# EAGLE design breakout (EAGLE 7.4.0)
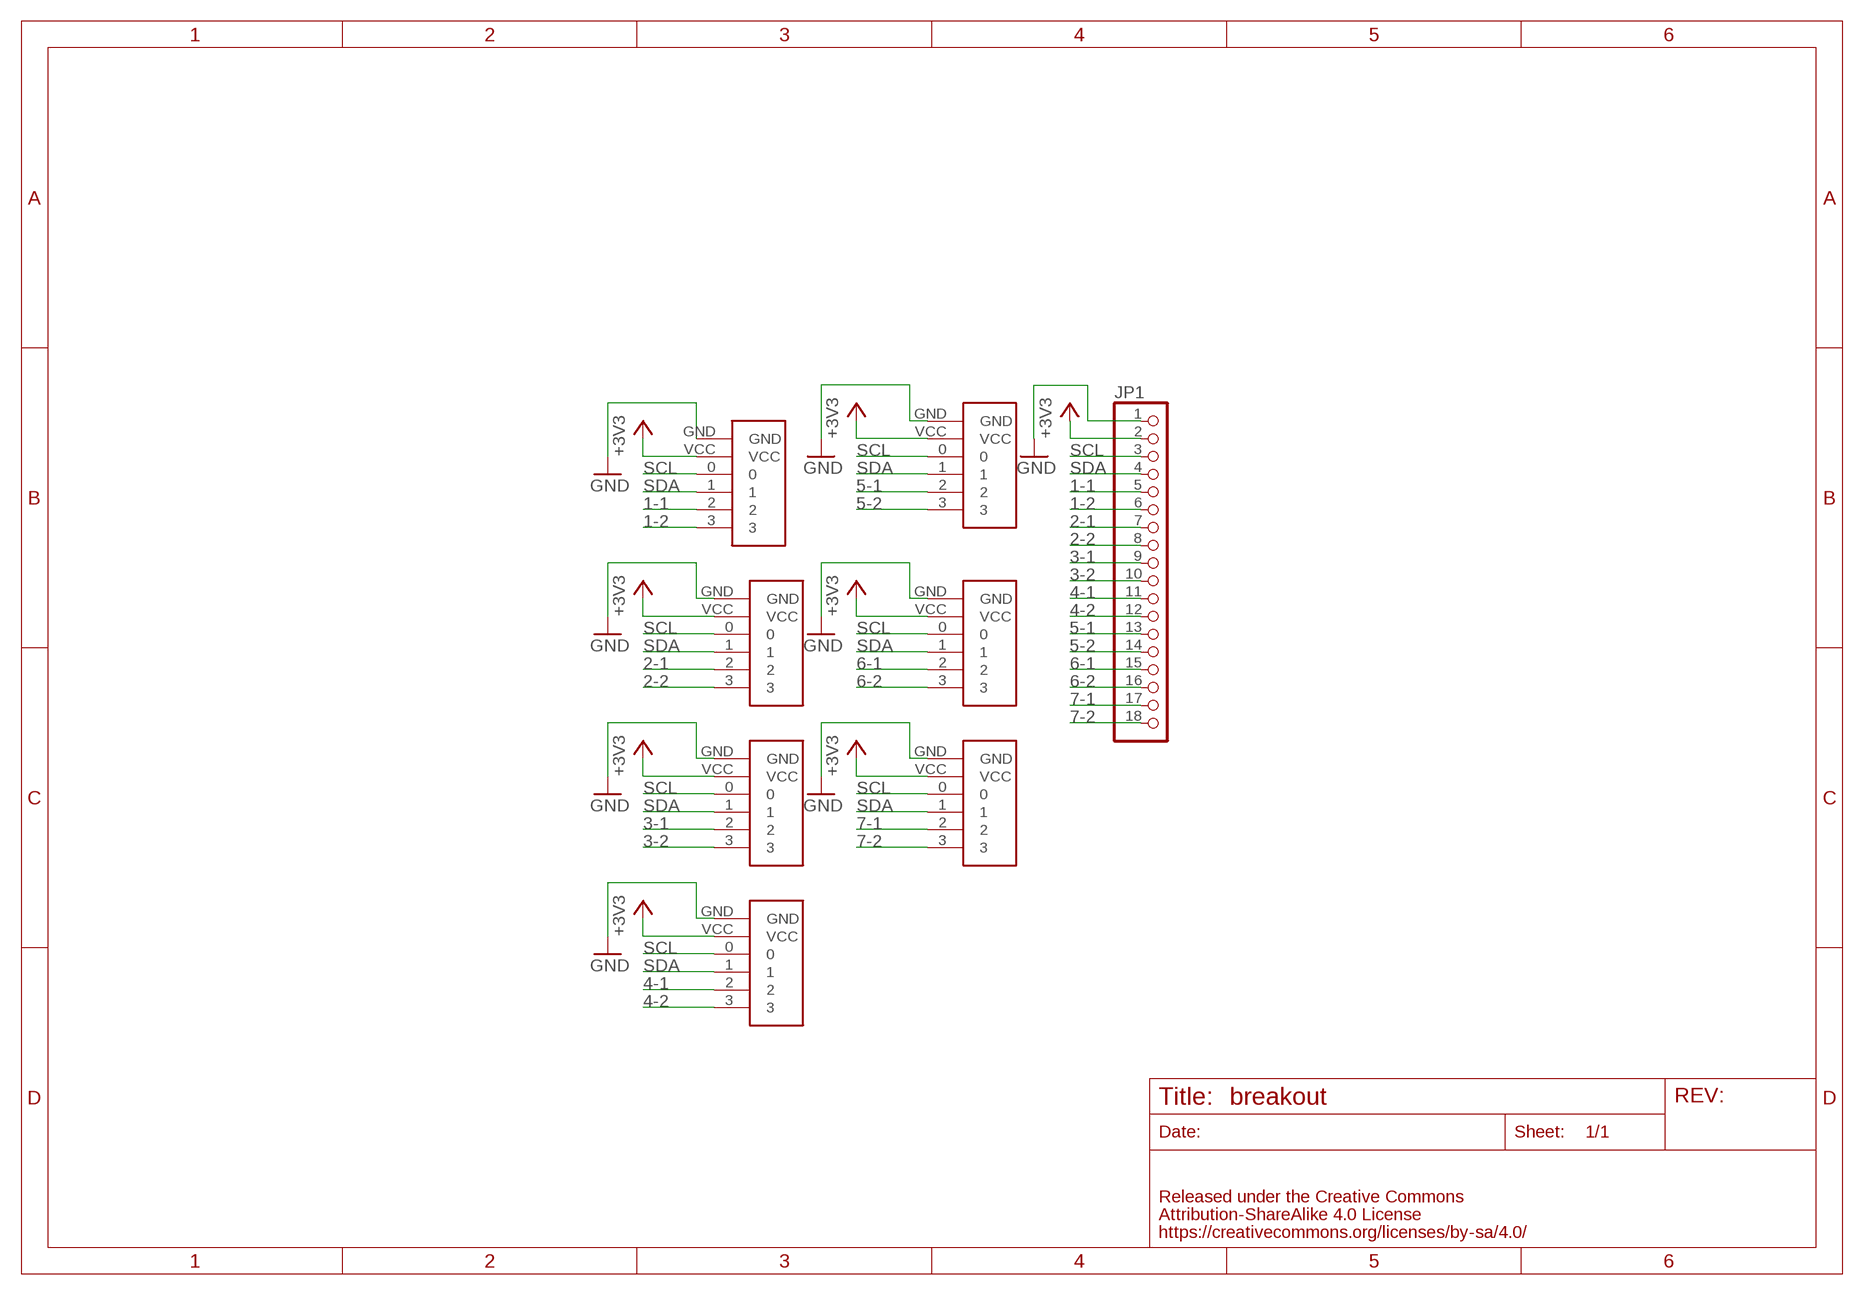
[diagram p0: schematic, sheet 1]

## Parts
1  FABO-PIN-HEADER-2X3-SMD  [FABO-PIN-HEADER-2X3-SMD]
2  FABO-PIN-HEADER-2X3-SMD  [FABO-PIN-HEADER-2X3-SMD]
3  FABO-PIN-HEADER-2X3-SMD  [FABO-PIN-HEADER-2X3-SMD]
4  FABO-PIN-HEADER-2X3-SMD  [FABO-PIN-HEADER-2X3-SMD]
5  FABO-PIN-HEADER-2X3-SMD  [FABO-PIN-HEADER-2X3-SMD]
6  FABO-PIN-HEADER-2X3-SMD  [FABO-PIN-HEADER-2X3-SMD]
7  FABO-PIN-HEADER-2X3-SMD  [FABO-PIN-HEADER-2X3-SMD]
JP1  PINHD-1X18  [1X18]

## Nets
1-1: 1.2 JP1.5
1-2: 1.3 JP1.6
2-1: 2.2 JP1.7
2-2: 2.3 JP1.8
3-1: 3.2 JP1.9
3-2: 3.3 JP1.10
4-1: 4.2 JP1.11
4-2: 4.3 JP1.12
5-1: 5.2 JP1.13
5-2: 5.3 JP1.14
6-1: 6.2 JP1.15
6-2: 6.3 JP1.16
7-1: 7.2 JP1.17
7-2: 7.3 JP1.18
+3V3: 1.VCC 2.VCC 3.VCC 4.VCC 5.VCC 6.VCC 7.VCC JP1.2
GND: 1.GND 2.GND 3.GND 4.GND 5.GND 6.GND 7.GND JP1.1
SCL: 1.0 2.0 3.0 4.0 5.0 6.0 7.0 JP1.3
SDA: 1.1 2.1 3.1 4.1 5.1 6.1 7.1 JP1.4

## Library data of the parts
1-7 = FaBo-PIN:FABO-PIN-HEADER-2X3-SMD
JP1 = pinhead:PINHD-1X18: PIN HEADER

## Board
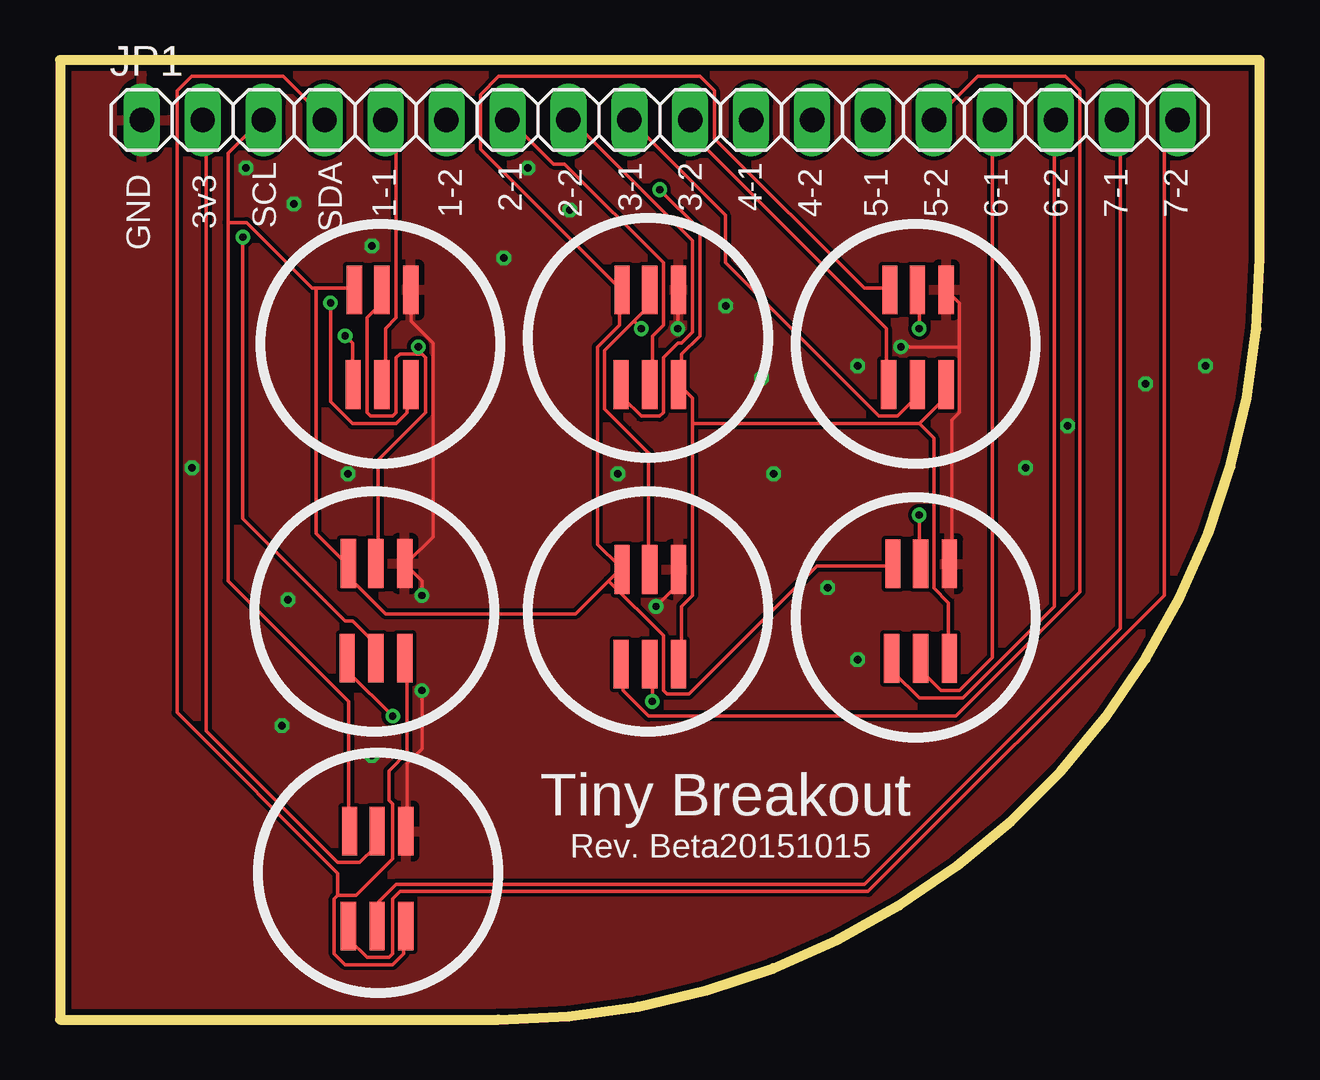
[diagram p1: board, top side]
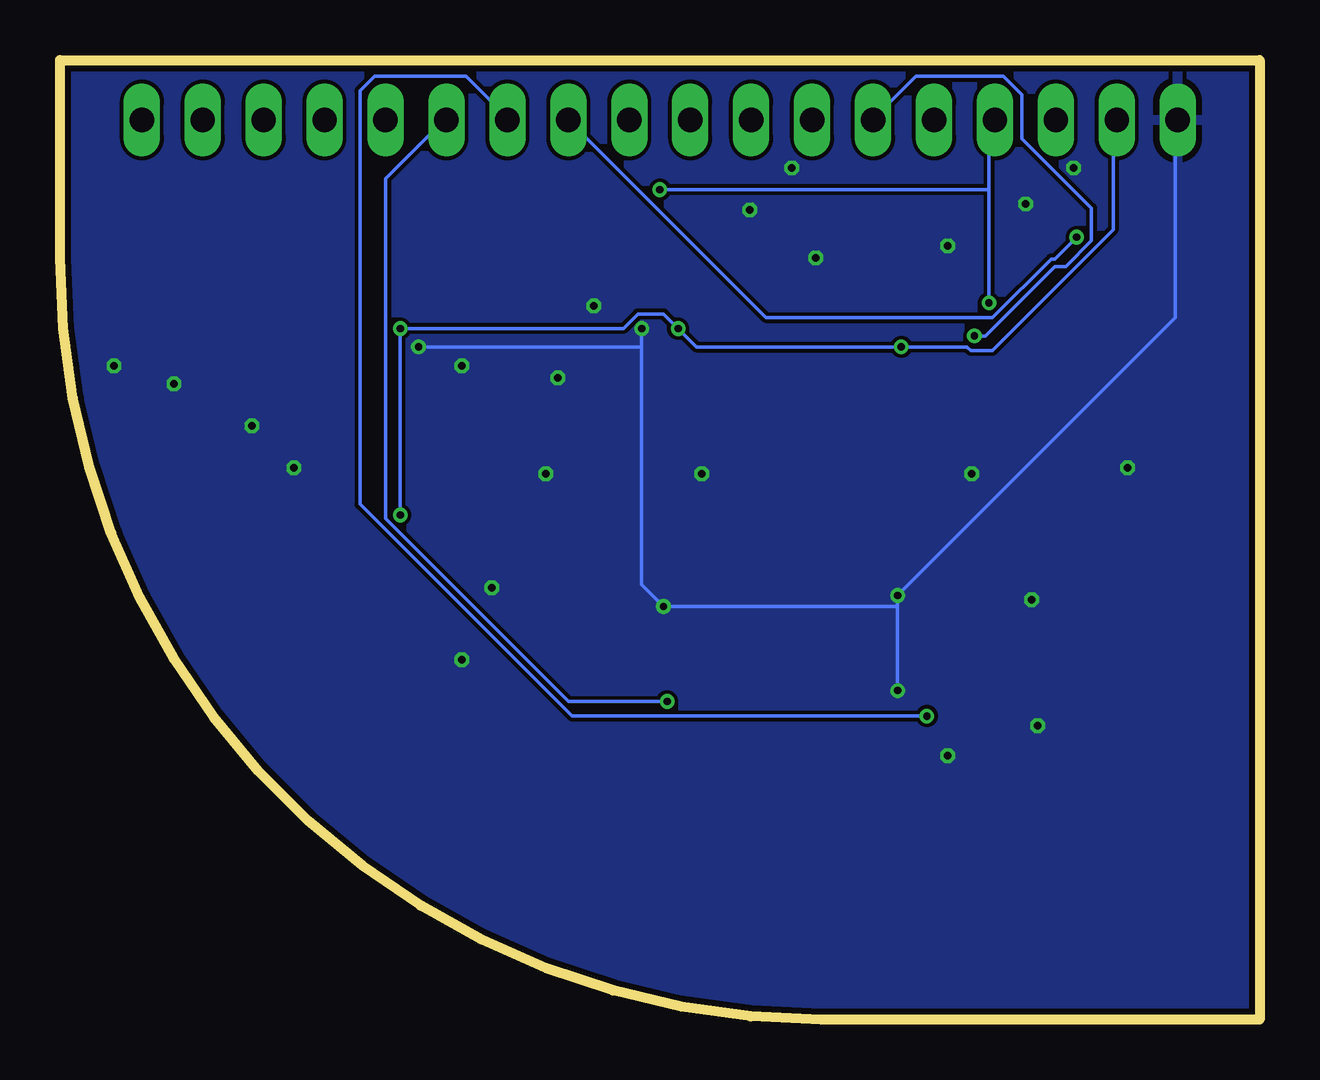
[diagram p2: board, bottom side, seen from below]

Size 50 x 40 mm. Coordinates in mm from the lower left corner, seen from the top.
Outline: 0,0 18.27,0 arc90 50,31.73 50,40 0,40 0,0
Copper layers (1*16): Top 0.035mm / dielectric 1.5mm / Bottom 0.035mm
Design rules "SeeedStudio_2layer_DRU_no_angle_20140221": minimum track width 6mil, minimum drill 12mil, track to track 6mil, track to pad 6mil, pad to pad 6mil, via to via 6mil, smd to smd 0mil, copper to edge 10mil, drill to drill 10mil, minimum pad ring 10mil, minimum via ring 6mil, stop-mask expansion 2mil, vias tented up to drill 100mil, thermal gap 10mil

### Footprints (pad centres in the part's own frame; a part is rotated, then mirrored left to right if it is on the bottom)
FABO-PIN-HEADER-2X3-SMD = smd 0.635 x 2.032: 0 -1.08,2; 1 1.27,-1.95; 2 0.07,-1.95; 3 -1.13,-1.95; GND 1.27,2; VCC 0.07,2
1X18 = drill 1.016 long: 1 -21.59,0; 2 -19.05,0; 3 -16.51,0; 4 -13.97,0; 5 -11.43,0; 6 -8.89,0; 7 -6.35,0; 8 -3.81,0; 9 -1.27,0; 10 1.27,0; 11 3.81,0; 12 6.35,0; 13 8.89,0; 14 11.43,0; 15 13.97,0; 16 16.51,0; 17 19.05,0; 18 21.59,0

### Placement (x,y rotation side)
1  13.35,28.42 0 top
2  24.51,28.42 0 top
3  35.67,28.42 0 top
4  13.1,17.01 0 top
5  24.51,16.76 0 top
6  35.8,17 0 top
7  13.15,5.85 0 top
JP1  25,37.5 0 top

### Tracks (layer width: path | path; a pad name or v marks a point on that pad's centre or on a via)
1-1
  Top 0.152: 1.2 13.56,26.52 13.56,28.8 14.02,29.26 14.02,37.19 13.72,37.49 JP1.5
1-2  (via drill 0.3)
  Top 0.152: v11.89,28.5 12.19,28.19 12.19,26.52 1.3
  Bottom 0.152: v11.89,28.5 11.43,28.5 8.53,31.39 8.08,31.39 7.01,32.46 7.01,33.83 9.91,36.73 9.91,38.56 10.67,39.32 14.33,39.32 16,37.64 JP1.6
2-1
  Top 0.152: 2.2 24.69,26.52 24.69,28.5 25.15,28.96 25.15,31.55 21.03,35.66 20.57,35.66 18.75,37.49 JP1.7
2-2
  Top 0.152: 2.3 23.47,26.36 23.47,25.91 24.23,25.15 24.99,25.15 25.15,25.3 25.15,27.58 25.76,28.19 25.91,28.19 26.36,28.65 26.36,32.46 21.34,37.49 JP1.8
3-1
  Top 0.152: 3.2 35.66,26.36 35.66,25.91 34.9,25.15 34.14,25.15 27.74,31.55 27.74,33.53 23.77,37.49 JP1.9
3-2
  Top 0.152: 3.3 34.44,26.52 34.44,28.8 26.36,36.88 26.36,37.49 JP1.10
4-1  (via drill 0.3)
  Top 0.152: v7.62,32.61 7.62,20.88 11.89,16.61 12.19,16.61 13.11,15.7 13.11,15.09 4.2
  Bottom 0.152: v7.62,32.61 8.53,31.7 8.69,31.7 11.12,29.26 20.57,29.26 JP1.11
4-2  (via drill 0.3)
  Top 0.152: v13.87,12.65 12.04,14.48 12.04,14.94 4.3
  Bottom 0.152: v13.87,12.65 28.65,12.65 37.49,21.49 37.49,38.71 36.88,39.32 33.07,39.32 31.39,37.64 JP1.12
5-1  (via drill 0.3)
  Top 0.152: v24.69,13.26 24.69,14.78 5.2
  Bottom 0.152: v24.69,13.26 28.8,13.26 36.42,20.88 36.42,35.05 33.98,37.49 JP1.13
5-2
  Top 0.152: 5.3 23.47,14.78 23.47,13.72 24.54,12.65 37.34,12.65 42.52,17.83 42.52,38.71 41.91,39.32 38.25,39.32 36.58,37.64 JP1.14
6-1
  Top 0.152: 6.2 35.97,14.94 35.97,14.48 36.73,13.72 37.49,13.72 38.86,15.09 38.86,37.49 JP1.15
6-2
  Top 0.152: 6.3 34.75,14.94 34.75,14.48 35.81,13.41 37.64,13.41 41.45,17.22 41.45,37.49 JP1.16
7-1
  Top 0.152: 7.2 13.26,3.96 13.26,4.88 14.02,5.64 33.53,5.64 44.2,16.31 44.2,37.49 JP1.17
7-2
  Top 0.152: 7.3 12.04,3.81 12.04,3.35 12.8,2.59 13.72,2.59 13.87,2.74 13.87,5.03 14.17,5.33 33.68,5.33 46.02,17.68 46.02,37.03 46.48,37.49 JP1.18
+3V3  (via drill 0.3)
  Top 0.152: 14.94,27.74 14.17,27.74 14.02,27.58 14.02,25.3 13.87,25.15 12.95,25.15 12.8,25.3 12.8,29.26 13.41,29.87 13.41,30.33 1.VCC | 14.94,27.74 15.09,27.74 15.24,27.58 15.24,25.3 13.26,23.32 13.26,19.05 4.VCC | v35.81,28.8 35.81,30.33 3.VCC | v35.81,21.03 35.81,19.05 6.VCC | 23.93,29.11 24.54,29.72 24.54,30.33 2.VCC | 23.93,29.11 22.71,27.89 22.71,25.45 24.54,23.62 24.54,18.9 5.VCC | 23.93,29.11 v24.23,28.8 | v14.94,28.04 14.94,27.74 | 7.VCC 13.11,7.77 13.11,7.16 12.5,6.55 11.58,6.55 6.1,12.04 6.1,37.49 JP1.2
  Bottom 0.152: v35.81,21.03 v35.81,28.8 26.52,28.8 25.91,29.41 24.84,29.41 v24.23,28.8 23.47,28.04 v14.94,28.04 12.19,28.04 12.04,27.89 11.12,27.89 6.1,32.92 6.1,37.49 JP1.2
GND  (via drill 0.3)
  Top 0.152: 37.49,28.04 37.49,29.87 37.03,30.33 3.GND | 37.49,28.04 37.49,25.3 37.19,24.99 37.19,19.05 6.GND | v15.09,13.72 15.09,11.28 14.48,10.67 14.48,7.92 7.GND | v15.09,17.68 15.09,18.29 14.48,18.9 4.GND 14.48,19.05 15.54,20.12 15.54,28.19 14.63,29.11 14.63,30.33 1.GND | v24.84,17.22 25.76,18.14 25.76,18.75 5.GND | v25.76,28.8 25.76,30.33 2.GND | v35.05,28.04 37.49,28.04
  Bottom 0.152: 15.09,17.22 v15.09,17.68 3.5,29.26 3.5,37.49 JP1.1 | 15.09,17.22 v15.09,13.72 | 15.09,17.22 v24.84,17.22 25.76,18.14 25.76,28.04 | 25.76,28.04 v25.76,28.8 | 25.76,28.04 v35.05,28.04
  other vias: 29.75,22.75 29.25,26.75 40.25,23 47.75,27.25 45.25,26.5 33.25,15 32,18 9.25,12.25 5.5,23 9.5,17.5 12,22.75 23.25,22.75 33.25,27.25 27.75,29.75 18.5,31.75 13,32.25 21.25,33.75 19.5,35.5 13,11 42,24.75 9.75,34 7.75,35.5
  pour Top: -0.25,-0.25 50,-0.25 50,39.75 -0.25,39.75
  pour Bottom: 0,-0.25 50,-0.25 50,40 0,40
SCL
  Top 0.152: 7.01,33.22 7.01,36.12 8.38,37.49 JP1.3 | 7.01,33.22 7.01,18.29 12.04,13.26 12.04,7.92 7.0 | 10.67,30.48 10.52,30.48 7.77,33.22 7.01,33.22 | 10.67,30.48 12.19,30.48 1.0 | 22.86,18.29 23.32,18.75 5.0 23.32,18.9 22.4,19.81 22.4,28.04 23.32,28.96 23.32,30.33 2.0 23.32,30.48 17.53,36.27 17.53,38.56 18.29,39.32 26.67,39.32 27.28,38.71 27.28,36.73 33.53,30.48 34.44,30.48 3.0 | 22.86,18.29 21.49,16.92 13.56,16.92 12.04,18.44 12.04,18.9 4.0 11.89,19.05 10.67,20.27 10.67,30.48 | 22.86,18.29 25.15,16 25.15,13.72 25.3,13.56 26.21,13.56 31.55,18.9 34.59,18.9 6.0
SDA  (via drill 0.3)
  Top 0.152: 26.36,24.84 26.36,25.91 25.91,26.36 2.1 25.91,26.52 25.91,27.74 26.67,28.5 26.67,32.92 v24.99,34.59 | 26.36,24.84 26.36,17.68 25.91,17.22 25.91,14.94 5.1 | 35.81,24.84 36.88,25.91 36.88,26.36 3.1 | 26.36,24.84 35.81,24.84 | 35.81,24.84 36.42,24.23 36.42,17.98 37.03,17.37 37.03,15.09 6.1 | 11.58,5.18 12.34,5.18 13.87,6.71 13.87,8.99 13.72,9.14 13.72,10.36 14.48,11.12 14.48,14.94 4.1 | 11.58,5.18 11.43,5.03 11.43,2.74 11.89,2.29 13.87,2.29 14.33,2.74 14.33,3.81 7.1 | v11.28,29.87 11.28,25.76 12.19,24.84 14.02,24.84 14.48,25.3 14.48,26.36 1.1 | 11.58,5.18 11.58,6.1 4.88,12.8 4.88,38.71 5.49,39.32 9.3,39.32 10.97,37.64 JP1.4
  Bottom 0.152: 11.28,34.59 11.28,37.34 11.12,37.49 JP1.4 | 11.28,34.59 v11.28,29.87 | 11.28,34.59 v24.99,34.59

### Text on the board
tPlace: SCL | SDA | 1-1 | 1-2 | 2-1 | 2-2 | 3-1 | 3-2 | 4-1 | 4-2 | 5-1 | 5-2 | 6-1 | 6-2 | 7-1 | 7-2 | GND | 3v3 | Tiny Breakout | Rev. Beta20151015